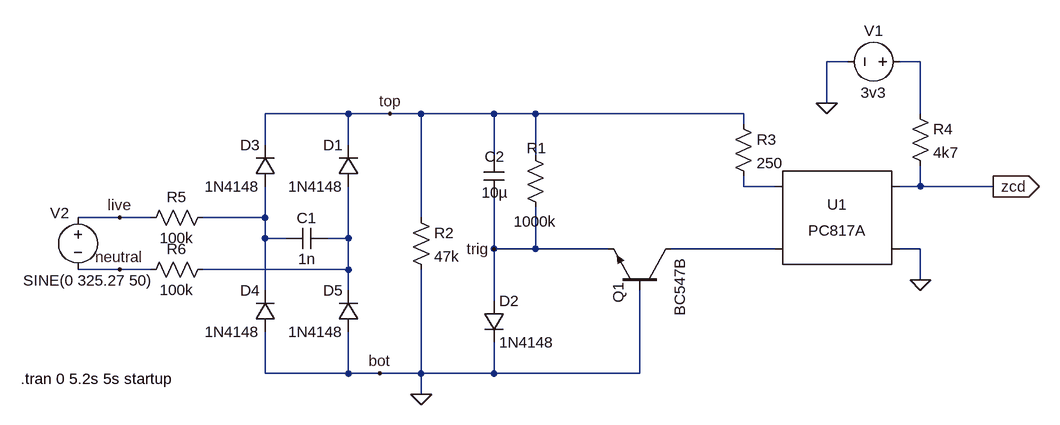
[diagram p0: schematic ZCD.asc]
ZCD.asc, the LTspice schematic file:
Version 4
SHEET 1 948 680
WIRE 624 -384 592 -384
WIRE 736 -384 704 -384
WIRE 592 -320 592 -384
WIRE -144 -304 -272 -304
WIRE -80 -304 -144 -304
WIRE -32 -304 -80 -304
WIRE 80 -304 -32 -304
WIRE 144 -304 80 -304
WIRE 464 -304 144 -304
WIRE 736 -304 736 -384
WIRE 464 -288 464 -304
WIRE -272 -256 -272 -304
WIRE -144 -256 -144 -304
WIRE 80 -240 80 -304
WIRE 144 -240 144 -304
WIRE 464 -192 464 -208
WIRE 512 -192 464 -192
WIRE 736 -192 736 -224
WIRE 736 -192 704 -192
WIRE 848 -192 736 -192
WIRE -496 -144 -560 -144
WIRE -448 -144 -496 -144
WIRE -272 -144 -272 -192
WIRE -272 -144 -368 -144
WIRE -32 -144 -32 -304
WIRE -272 -112 -272 -144
WIRE -240 -112 -272 -112
WIRE -144 -112 -144 -192
WIRE -144 -112 -176 -112
WIRE 80 -96 80 -176
WIRE 144 -96 144 -160
WIRE 144 -96 80 -96
WIRE 256 -96 144 -96
WIRE 512 -96 352 -96
WIRE 736 -96 704 -96
WIRE -496 -64 -560 -64
WIRE -448 -64 -496 -64
WIRE -144 -64 -144 -112
WIRE -144 -64 -368 -64
WIRE 736 -48 736 -96
WIRE -272 -32 -272 -112
WIRE -144 -32 -144 -64
WIRE 80 -16 80 -96
WIRE -272 96 -272 32
WIRE -144 96 -144 32
WIRE -144 96 -272 96
WIRE -96 96 -144 96
WIRE -32 96 -32 -64
WIRE -32 96 -96 96
WIRE 80 96 80 48
WIRE 80 96 -32 96
WIRE 304 96 304 -32
WIRE 304 96 80 96
WIRE -32 128 -32 96
FLAG 592 -320 0
FLAG 848 -192 zcd
IOPIN 848 -192 Out
FLAG 736 -48 0
FLAG -80 -304 top
FLAG -96 96 bot
FLAG 80 -96 trig
FLAG -32 128 0
FLAG -496 -144 live
FLAG -496 -64 neutral
SYMBOL diode -128 -192 R180
WINDOW 0 24 64 Left 2
WINDOW 3 24 0 Left 2
SYMATTR InstName D1
SYMATTR Value 1N4148
SYMBOL res 128 -256 R0
WINDOW 0 2 5 Left 2
WINDOW 3 -18 118 Left 2
SYMATTR InstName R1
SYMATTR Value 1000k
SYMBOL diode 64 -16 R0
SYMATTR InstName D2
SYMATTR Value 1N4148
SYMBOL diode -256 -192 R180
WINDOW 0 24 64 Left 2
WINDOW 3 24 0 Left 2
SYMATTR InstName D3
SYMATTR Value 1N4148
SYMBOL diode -256 32 R180
WINDOW 0 24 64 Left 2
WINDOW 3 24 0 Left 2
SYMATTR InstName D4
SYMATTR Value 1N4148
SYMBOL cap -176 -128 R90
WINDOW 0 0 32 VBottom 2
WINDOW 3 32 32 VTop 2
SYMATTR InstName C1
SYMATTR Value 1n
SYMBOL cap 64 -240 R0
WINDOW 0 2 2 Left 2
WINDOW 3 -3 57 Left 2
SYMATTR InstName C2
SYMATTR Value 10µ
SYMBOL res -48 -160 R0
SYMATTR InstName R2
SYMATTR Value 47k
SYMBOL res 448 -304 R0
SYMATTR InstName R3
SYMATTR Value 250
SYMBOL res 720 -320 R0
SYMATTR InstName R4
SYMATTR Value 4k7
SYMBOL res -352 -160 R90
WINDOW 0 0 56 VBottom 2
WINDOW 3 32 56 VTop 2
SYMATTR InstName R5
SYMATTR Value 100k
SYMBOL res -352 -80 R90
WINDOW 0 0 56 VBottom 2
WINDOW 3 32 56 VTop 2
SYMATTR InstName R6
SYMATTR Value 100k
SYMBOL diode -128 32 R180
WINDOW 0 24 64 Left 2
WINDOW 3 24 0 Left 2
SYMATTR InstName D5
SYMATTR Value 1N4148
SYMBOL Optos\\PC817A 608 -144 R0
SYMATTR InstName U1
SYMBOL npn 352 -32 M270
WINDOW 0 -20 81 Left 2
WINDOW 3 -39 -14 Left 2
SYMATTR InstName Q1
SYMATTR Value BC547B
SYMBOL voltage 720 -384 R90
WINDOW 0 -32 56 VBottom 2
WINDOW 3 32 56 VTop 2
WINDOW 123 0 0 Left 0
WINDOW 39 0 0 Left 0
SYMATTR InstName V1
SYMATTR Value 3v3
SYMBOL voltage -560 -160 R0
WINDOW 0 -43 9 Left 2
WINDOW 3 -84 113 Left 2
WINDOW 123 0 0 Left 0
WINDOW 39 0 0 Left 0
SYMATTR InstName V2
SYMATTR Value SINE(0 325.27 50)
TEXT -648 104 Left 2 !.tran 0 5.2s 5s startup

The netlist it stands for:
* ZCD.asc
D1 N004 top 1N4148
R1 top trig 1000k
D2 trig 0 1N4148
D3 N003 top 1N4148
D4 0 N003 1N4148
C1 N004 N003 1n
C2 top trig 10µ
R2 top 0 47k
R3 top N002 250
R4 N001 zcd 4k7
R5 N003 live 100k
R6 N004 neutral 100k
D5 0 N004 1N4148
XU1 N002 N005 zcd 0 PC817 Igain=1m
Q1 N005 0 trig 0 BC547B
V1 N001 0 3v3
V2 live neutral SINE(0 325.27 50)
.model D D
.lib standard.dio
.model NPN NPN
.model PNP PNP
.lib standard.bjt
.tran 0 5.2s 5s startup
.lib PC817.sub
.backanno
.end